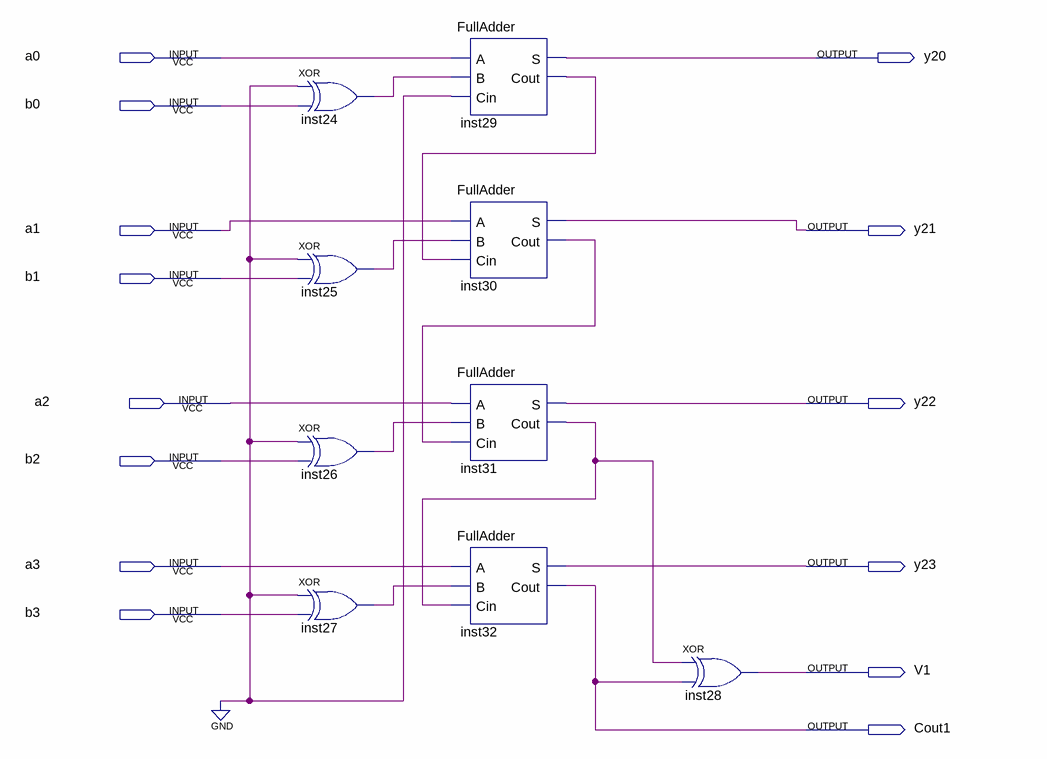
[diagram p0: schematic sheet]
// Quartus schematic Add.bdf as structural Verilog: 9 symbols, 14 pins
module Add (
  input  a0,
  input  b0,
  input  a1,
  input  b1,
  input  a2,
  input  b2,
  input  a3,
  input  b3,
  output y20,
  output y21,
  output y22,
  output y23,
  output V1,
  output Cout1
);

  wire inst24_out, inst25_out, inst26_out, inst27_out, inst29_cout, inst30_cout, inst31_cout;

  xor inst24 (inst24_out, 1'b0, b0);
  xor inst25 (inst25_out, 1'b0, b1);
  xor inst26 (inst26_out, 1'b0, b2);
  xor inst27 (inst27_out, 1'b0, b3);
  FullAdder inst29 (.A(a0), .B(inst24_out), .Cin(1'b0), .S(y20), .Cout(inst29_cout));
  FullAdder inst30 (.A(a1), .B(inst25_out), .Cin(inst29_cout), .S(y21), .Cout(inst30_cout));
  FullAdder inst31 (.A(a2), .B(inst26_out), .Cin(inst30_cout), .S(y22), .Cout(inst31_cout));
  FullAdder inst32 (.A(a3), .B(inst27_out), .Cin(inst31_cout), .S(y23), .Cout(Cout1));
  xor inst28 (V1, inst31_cout, Cout1);
endmodule
